# Altium project SPECTRE_3.0.PrjPcb
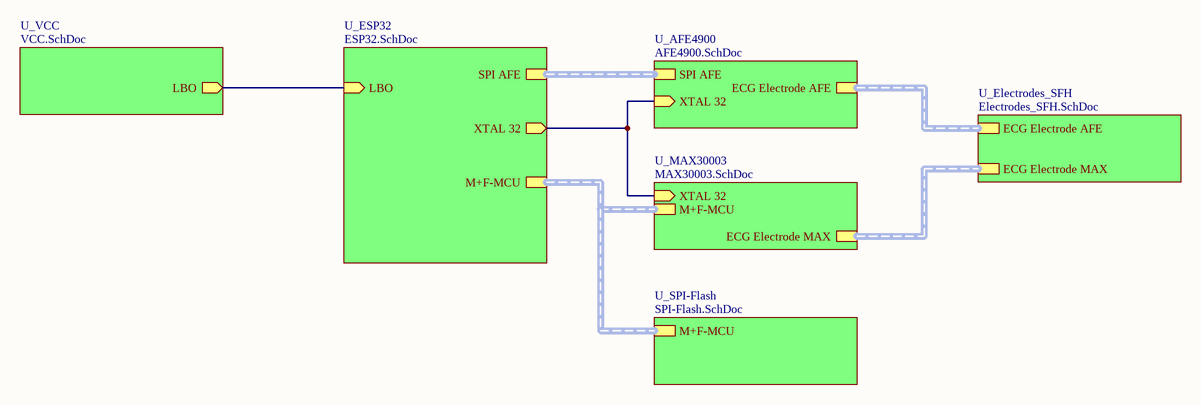
[diagram p0: Topsheet_SPECTRE3.0.SchDoc]
7 sheets, 70 parts. Net scope: hierarchical (ports join the sheet entries above them; power ports are global).
Board file: SPECTRE_3.0.PcbDoc
Sheets:
  Topsheet_SPECTRE3.0.SchDoc
    U_VCC = VCC.SchDoc
    U_Electrodes_SFH = Electrodes_SFH.SchDoc
    U_ESP32 = ESP32.SchDoc
    U_SPI-Flash = SPI-Flash.SchDoc
    U_MAX30003 = MAX30003.SchDoc
    U_AFE4900 = AFE4900.SchDoc

## Sheet Topsheet_SPECTRE3.0.SchDoc
size A4

### Sub-sheets
U_AFE4900 = AFE4900.SchDoc: XTAL 32 (in), ECG Electrode AFE (harness ECG Electrode AFE), SPI AFE (harness SPI AFE)
U_Electrodes_SFH = Electrodes_SFH.SchDoc: ECG Electrode AFE (harness ECG Electrode AFE), ECG Electrode MAX (harness ECG Electrode MAX)
U_ESP32 = ESP32.SchDoc: XTAL 32 (out), M+F-MCU (harness M+F-MCU), SPI AFE (harness SPI AFE), LBO (in)
U_MAX30003 = MAX30003.SchDoc: ECG Electrode MAX (harness ECG Electrode MAX), XTAL 32 (in), M+F-MCU (harness M+F-MCU)
U_SPI-Flash = SPI-Flash.SchDoc: M+F-MCU (harness M+F-MCU)
U_VCC = VCC.SchDoc: LBO (out)

### Nets
AFE CLK: sheet U_ESP32/XTAL 32, sheet U_MAX30003/XTAL 32, sheet U_AFE4900/XTAL 32
NetR19_1: sheet U_VCC/LBO, sheet U_ESP32/LBO

### Buses and harness runs
harness sheet U_AFE4900/ECG Electrode AFE = sheet U_Electrodes_SFH/ECG Electrode AFE
harness sheet U_AFE4900/SPI AFE = sheet U_ESP32/SPI AFE
harness sheet U_Electrodes_SFH/ECG Electrode MAX = sheet U_MAX30003/ECG Electrode MAX
harness sheet U_ESP32/M+F-MCU = sheet U_MAX30003/M+F-MCU = sheet U_SPI-Flash/M+F-MCU

## Sheet VCC.SchDoc
size A4
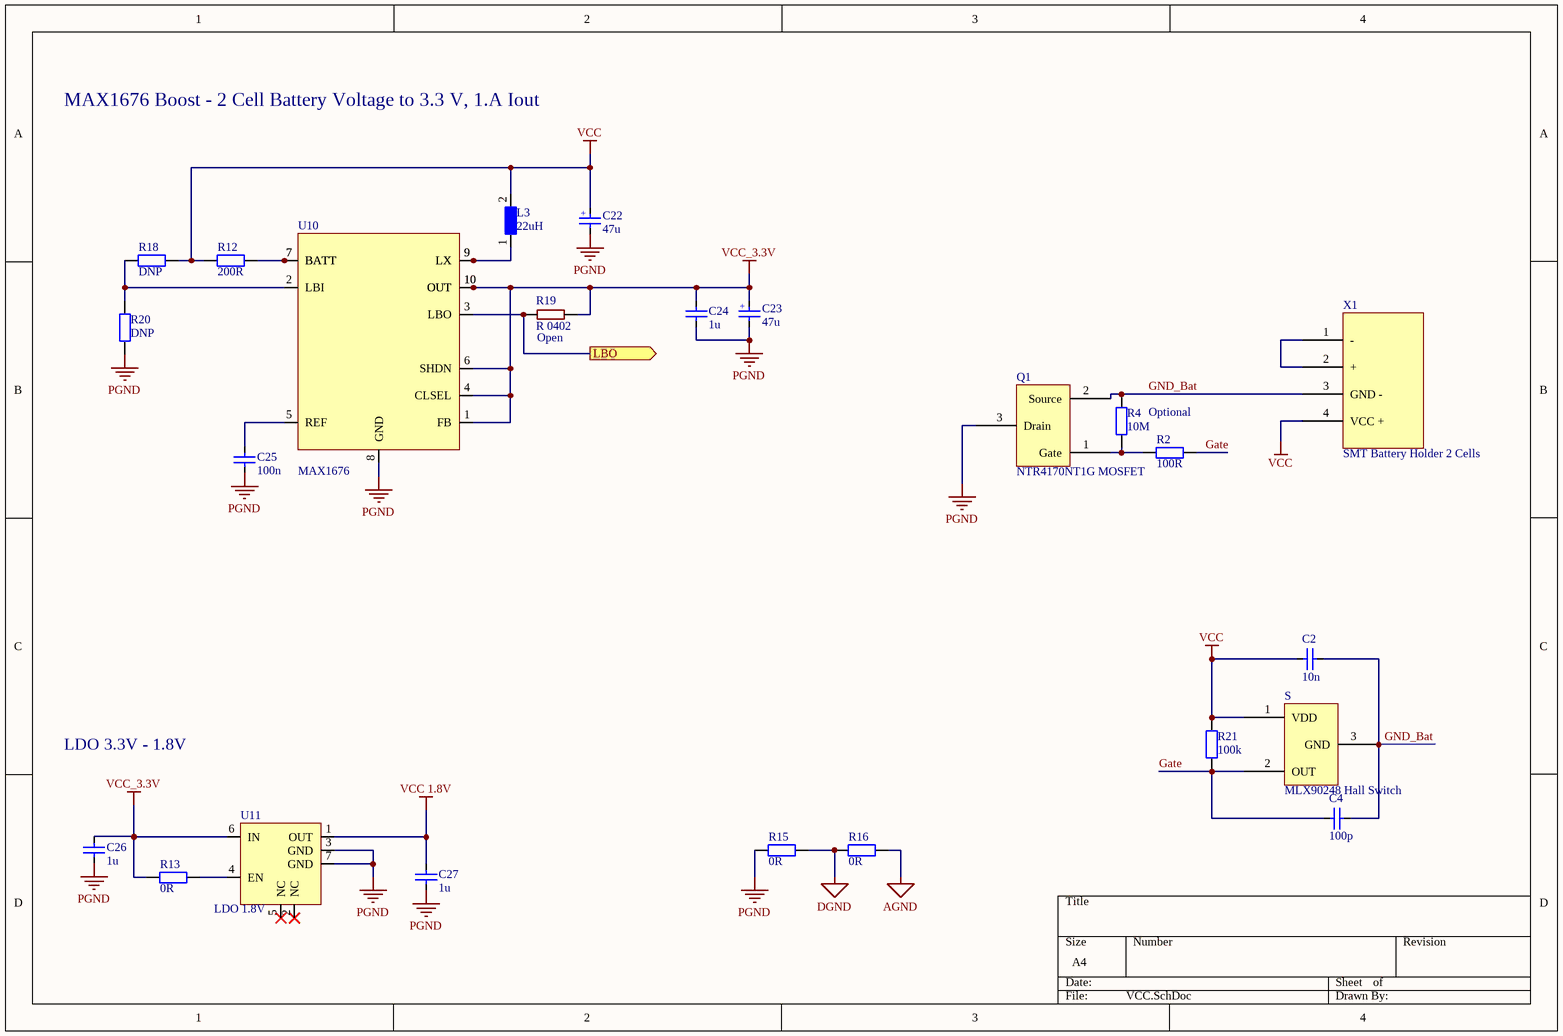
[diagram p1: VCC.SchDoc]

### Parts
C2  10n  [CAPC1005X03N]
C4  100p  [CAPC1005X03N]
C22  47u  [AVX TPSC476M016R0350]
C23  47u  [AVX TPSD107M010R0100 100uF]
C24  1u  [CAPC1608X05N]
C25  100n  [CAPC1608X05N]
C26  1u  [CAPC1608X05N]
C27  1u  [CAPC1608X05N]
L3  22uH  [CD54-220]
Q1  NTR4170NT1G MOSFET  [NTR4170NT1G]
R2  100R  [RESC1005X03N]
R4  10M  [RESC1608X05N]
R12  200R  [RESC1608X05N]
R13  0R  [RESC1608X05N]
R15  0R  [RESC2012X05N]
R16  0R  [RESC2012X05N]
R18  DNP  [RESC1005X03N]
R19  R 0402  [R 0402]
R20  DNP  [RESC1005X03N]
R21  100k  [RESC1005X03N]
S  MLX90248 Hall Switch  [MLX90248]
U10  MAX1676  [MAX1676-Boost]
U11  LDO 1.8V  [TLV75518PDRVR]
X1  SMT Battery Holder 2 Cells  [SMT Battery Holder]

### Ports
LBO (out)

### Nets
AGND: R16.2
DGND: R15.2 R16.1
PGND: C22.2 C23.2 C24.1 C25.2 C26.1 C27.1 Q1.3(Drain) R15.1 R20.1 U10.8(GND) U11.3(GND) U11.7(GND)
VCC: C2.2 C22.1 L3.2 R12.1 R18.2 R21.2 S.1(VDD) X1.4(VCC_+)
VCC 1.8V: C27.2 U11.1(OUT)
VCC_3.3V: C23.1 C24.2 C26.2 R13.1 R19.2 U10.1(FB) U10.4(CLSEL) U10.6(SHDN) U10.10(OUT) U11.6(IN)  [project net TX SUP]
Gate: C4.1 R2.1 R21.1 S.2(OUT)
GND_Bat: C2.1 C4.2 Q1.2(Source) R4.2 S.3(GND) X1.3(GND_-)
NetC25_1: C25.1 U10.5(REF)
NetL3_1: L3.1 U10.9(LX)
NetQ1_1: Q1.1(Gate) R2.2 R4.1
NetR12_2: R12.2 U10.7(BATT)
NetR13_2: R13.2 U11.4(EN)
NetR18_1: R18.1 R20.2 U10.2(LBI)
NetR19_1: R19.1 U10.3(LBO) ; port LBO
NetX1_1: X1.1(-) X1.2(+)

Not connected (* = marked no-connect by the designer): U11 2(NC)* 5(NC)*

### Notes on the sheet
- MAX1676 Boost - 2 Cell Battery Voltage to 3.3 V, 1.A Iout
- (near R19) Open
- Optional
- LDO 3.3V - 1.8V
- (in symbol C_47u_16V_2312) +
- (in symbol C_100u_10V_2917) +

### Library data of the parts
C2 = C_10n_50V_0402: Kondensator 10n 50V 0402; Tested: False; Supplier 1: Farnell; Supplier Part Number 1: 1828887
C4 = C_100p_50V_0402: Kondensator 100p 50V 0402; Tested: False; Supplier 1: Farnell
C22 = C_47u_16V_2312: Kondensator 47u 16V Tanatalum Capacitor; Cart: https://www.mouser.de/ProductDetail/AVX/TPSC476M016R0350?qs=%2Fha2pyFaduhj%252BASDCSGgk2azjUMSnKvo3TkO6PkyHka4p8K%2FssSCRw%3D%3D; Datasheet: https://www.mouser.de/datasheet/2/40/tps-776850.pdf
C23 = C_100u_10V_2917: Kondensator 100u 10V Tanatalum Capacitor; Cart: https://www.mouser.de/ProductDetail/AVX/TPSC476M016R0350?qs=%2Fha2pyFaduhj%252BASDCSGgk2azjUMSnKvo3TkO6PkyHka4p8K%2FssSCRw%3D%3D; Datasheet: https://www.mouser.de/datasheet/2/40/tps-776850.pdf
C24 C26 C27 = C_1u_25V_0603: Kondensator 1u 25V X7R 0603; Tested: False; Supplier 1: Farnell; Supplier Part Number 1: 2495176
C25 = C_100n_50V_0603: Kondensator 100n 50V 0603; Supplier 1: Farnell; Supplier Part Number 1: 1759122
L3 = L_22uH_CD54-220: 22uH power inductor (1.1 A) Sumida CD54-220; Cart: https://www.digikey.de/product-detail/de/sumida-america-components-inc/CD54NP-220MC/308-2271-1-ND/4356341; Datasheet: http://products.sumida.com/products/pdf/CD54.pdf
Q1 = NTR4170NT1G MOSFET: NTR4170NT1G MOSFET 30V 3.9A
R2 = R_100R_0402: Widerstand 100R 1% 0402; Tested: False; Supplier 1: Farnell; Supplier Part Number 1: 9239111
R4 = R_10M_0603: Widerstand 10M 1% 100mW 75V 0603; Tested: False; Supplier 1: Mouser; Supplier Part Number 1: 660-RK73H1JTTD1005F
R12 = R_200R_0603: Widerstand 200R 1% 100mW 50V 0603; Tested: False; Supplier 1: Farnell; Supplier Part Number 1: 2447292
R13 = R_0R_0603: Widerstand 0R 0603; Tested: False; Supplier 1: Farnell; Supplier Part Number 1: 2059527
R15 R16 = R_0R_0805: Widerstand 0R 0805; Tested: False; Supplier 1: Farnell; Supplier Part Number 1: 2057661
R18 R20 = R_0R_0402: Widerstand 0R 0402; Tested: True; Supplier 1: Farnell; Supplier Part Number 1: 2059190
R21 = R_10k_0402: Widerstand 100k 1% 0402; Tested: False; Supplier 1: Farnell; Supplier Part Number 1: 1358069
U10 = MAX1676: Boost, Step-Up DC-DC Converter
U11 = LDO_1.8V_TLV75518PDRVR
X1 = SMT Battery Holder 2 Cells: SMT Battery Holder, Keystone Electronics, 2 Cells AAA; Cart: https://www.digikey.de/product-detail/de/keystone-electronics/1022/36-1022-ND/2137859; Datasheet: https://www.keyelco.com/userAssets/file/M65p23.pdf

## Sheet Electrodes_SFH.SchDoc
size A4
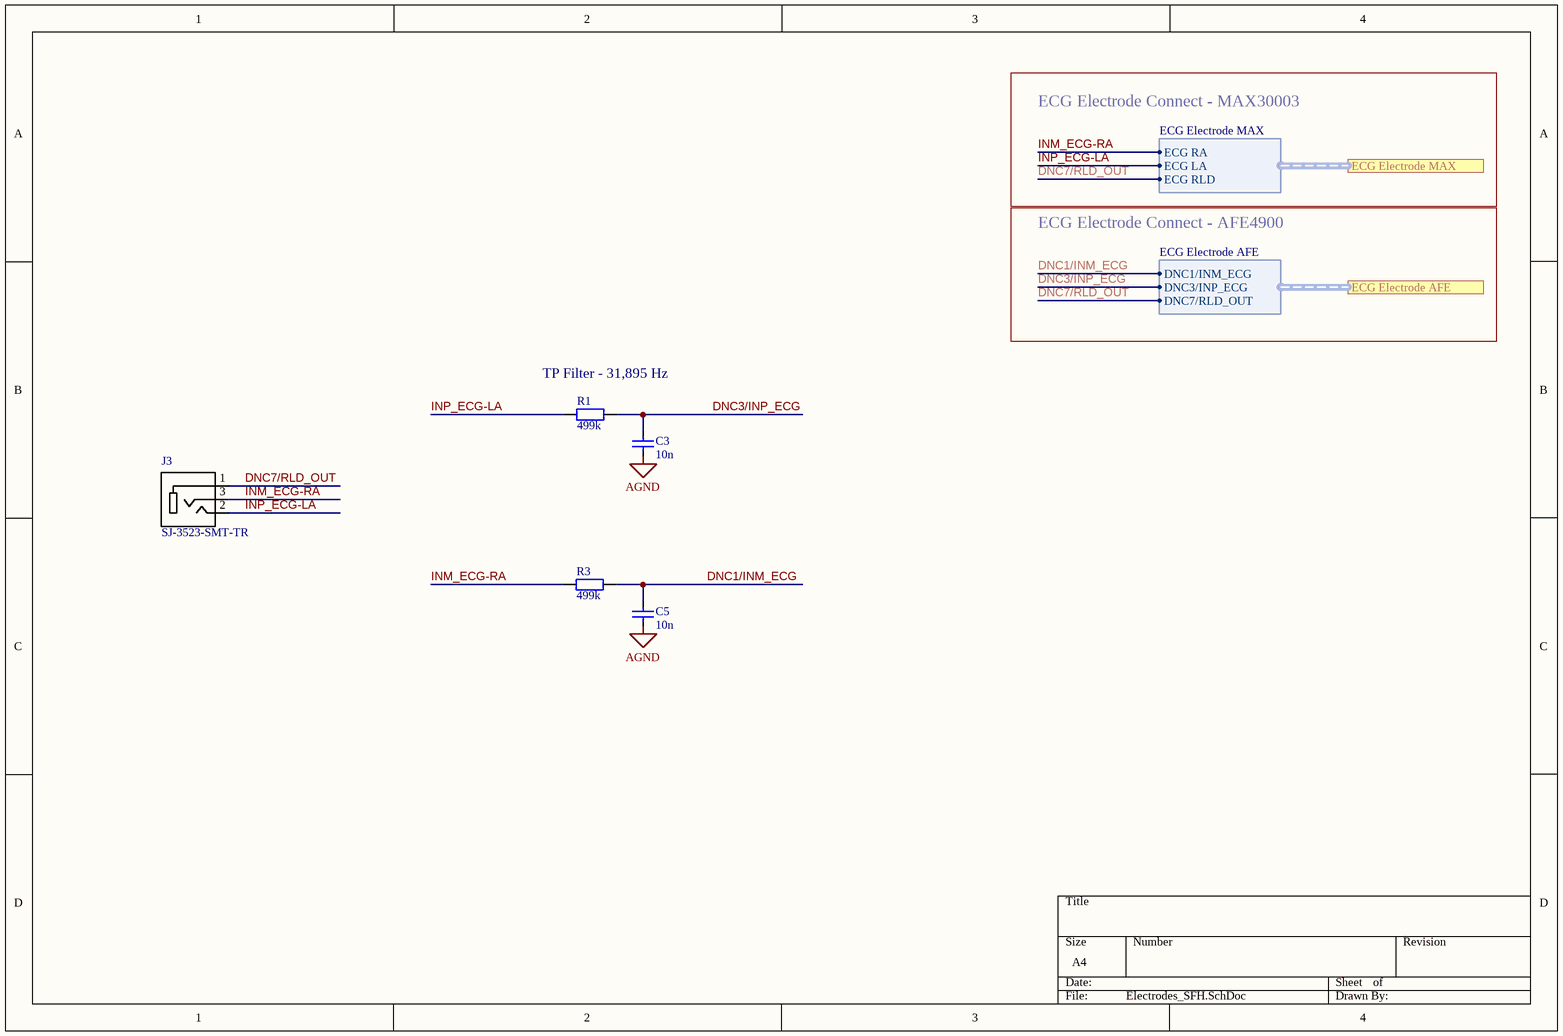
[diagram p2: Electrodes_SFH.SchDoc]

### Parts
C3  10n  [CAPC1005X03N]
C5  10n  [CAPC1005X03N]
J3  SJ-3523-SMT-TR  [*CUI_SJ-3523-SMT-TR]
R1  499k  [RESC1005X03N]
R3  499k  [RESC1005X03N]

### Ports
ECG Electrode AFE (harness ECG Electrode AFE), ECG Electrode MAX (harness ECG Electrode MAX)

### Harnesses
ECG Electrode AFE: DNC3/INP_ECG, DNC7/RLD_OUT, DNC1/INM_ECG
ECG Electrode MAX: ECG RA, ECG LA, ECG RLD

### Nets
AGND: C3.1 C5.1
DNC1/INM_ECG: C5.2 R3.2 ; port ECG Electrode AFE.DNC1/INM_ECG
DNC3/INP_ECG: C3.2 R1.2 ; port ECG Electrode AFE.DNC3/INP_ECG
DNC7/RLD_OUT: J3.1 ; port ECG Electrode AFE.DNC7/RLD_OUT, port ECG Electrode MAX.ECG RLD
INM_ECG-RA: J3.3 R3.1 ; port ECG Electrode MAX.ECG RA  [project net ECG RA]
INP_ECG-LA: J3.2 R1.1 ; port ECG Electrode MAX.ECG LA  [project net ECG LA]

### Notes on the sheet
- ECG Electrode Connect - MAX30003
- ECG Electrode Connect - AFE4900
- (near R1) TP Filter - 31,895 Hz

### Library data of the parts
C3 C5 = C_10n_50V_0402: Kondensator 10n 50V 0402; Tested: False; Supplier 1: Farnell; Supplier Part Number 1: 1828887
R1 R3 = R_0402: Widerstand 0402; Tested: False
J3 = SJ-3523-SMT-TR: Value: *

## Sheet ESP32.SchDoc
size A4
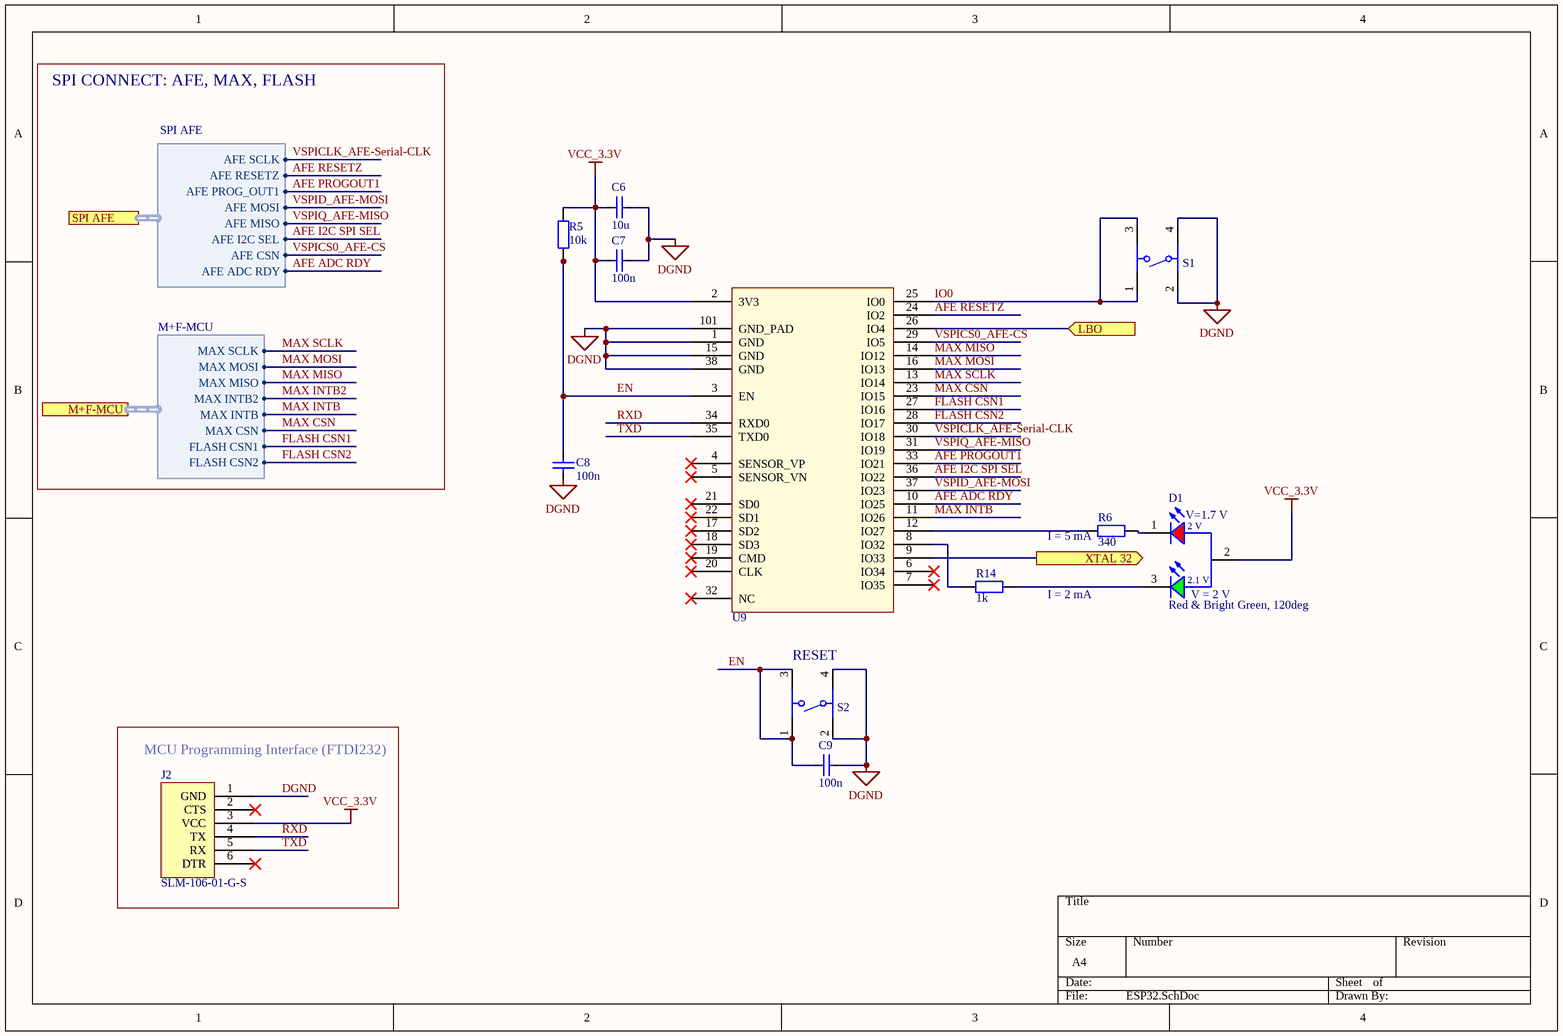
[diagram p3: ESP32.SchDoc]

### Parts
C6  10u  [CAPC1608X05N]
C7  100n  [CAPC1005X03N]
C8  100n  [CAPC1005X03N]
C9  100n  [CAPC1005X03N]
D1  Red & Bright Green, 120deg  [WL-SBSW_1204]
J2  SLM-106-01-G-S  [SLM-106-01-G-S]
R5  10k  [RESC1005X03N]
R6  340  [RESC1005X03N]
R14  1k  [RESC1005X03N]
S1  434153017835  [434153017835]  (value not drawn)
S2  434153017835  [434153017835]  (value not drawn)
U9  ESP32  [ESP32-WROOM-32]  (value not drawn)

### Blocks framed on the sheet
MCU Programming Interface (FTDI232): J2

### Ports
LBO (in), M+F-MCU (harness M+F-MCU), SPI AFE (harness SPI AFE), XTAL 32 (out)

### Harnesses
M+F-MCU: MAX CSN, MAX INTB, MAX INTB2, MAX MISO, MAX MOSI, MAX SCLK, FLASH CSN1, FLASH CSN2
SPI AFE: AFE ADC RDY, AFE CSN, AFE I2C SEL, AFE MISO, AFE MOSI, AFE PROG_OUT1, AFE RESETZ, AFE SCLK

### Nets
DGND: C6.2 C7.2 C8.1 C9.2 J2.1(GND) S1.2 S1.4 S2.2 S2.4 U9.1(GND) U9.15(GND) U9.38(GND) U9.101(GND_PAD)
VCC_3.3V: C6.1 C7.1 D1.2(A) J2.3(VCC) R5.2 U9.2(3V3)  [project net TX SUP]
AFE ADC RDY: U9.10(IO25) ; port SPI AFE.AFE ADC RDY
AFE CLK: U9.9(IO33) ; port XTAL 32
AFE I2C SPI SEL: U9.36(IO22) ; port SPI AFE.AFE I2C SEL
AFE PROGOUT1: U9.33(IO21) ; port SPI AFE.AFE PROG_OUT1
AFE RESETZ: U9.24(IO2) ; port SPI AFE.AFE RESETZ
EN: C8.2 C9.1 R5.1 S2.1 S2.3 U9.3(EN)
FLASH CSN1: U9.27(IO16) ; port M+F-MCU.FLASH CSN1
FLASH CSN2: U9.28(IO17) ; port M+F-MCU.FLASH CSN2
IO0: S1.1 S1.3 U9.25(IO0)
MAX CSN: U9.23(IO15) ; port M+F-MCU.MAX CSN  [project net HSPICS0_MAX-CS]
MAX INTB: U9.11(IO26) ; port M+F-MCU.MAX INTB
MAX INTB2: port M+F-MCU.MAX INTB2
MAX MISO: U9.14(IO12) ; port M+F-MCU.MAX MISO  [project net Flash MISO]
MAX MOSI: U9.16(IO13) ; port M+F-MCU.MAX MOSI  [project net Flash MOSI]
MAX SCLK: U9.13(IO14) ; port M+F-MCU.MAX SCLK  [project net CLK]
RXD: J2.4(TX) U9.34(RXD0)
TXD: J2.5(RX) U9.35(TXD0)
VSPICLK_AFE-Serial-CLK: U9.30(IO18) ; port SPI AFE.AFE SCLK  [project net AFE I2C CLK]
VSPICS0_AFE-CS: U9.29(IO5) ; port SPI AFE.AFE CSN  [project net SEN]
VSPID_AFE-MOSI: U9.37(IO23) ; port SPI AFE.AFE MOSI  [project net AFE I2C DAT]
VSPIQ_AFE-MISO: U9.31(IO19) ; port SPI AFE.AFE MISO  [project net SDOUT]
NetD1_1: D1.1(K) R6.2
NetD1_3: D1.3(K) R14.2
NetR6_1: R6.1 U9.12(IO27)
NetR14_1: R14.1 U9.8(IO32)
NetR19_1: U9.26(IO4) ; port LBO

Not connected (* = marked no-connect by the designer): J2 2(CTS)* 6(DTR)*; U9 4(SENSOR_VP)* 5(SENSOR_VN)* 6(IO34)* 7(IO35)* 17(SD2)* 18(SD3)* 19(CMD)* 20(CLK)* 21(SD0)* 22(SD1)* 32(NC)*

### Notes on the sheet
- SPI CONNECT: AFE, MAX, FLASH
- (near D1) V=1.7 V
- (near R6) I = 5 mA
- I = 2 mA
- (near D1) V = 2 V
- (near S2) RESET
- (in symbol 155124RV73200) 2 V; 2.1 V

### Library data of the parts
C6 = C_10u_10V_0603: Kondensator 10u 10V 0603; Supplier 1: Farnell; Supplier Part Number 1: 2521952
C7-C9 = C_100n_50V_0402: Kondensator 100n 50V 0402; Tested: False; Supplier 1: Farnell; Supplier Part Number 1: 2210822
D1 = 155124RV73200: WL-SBSW SMT Bi-color Side View Waterclear, size 1204, Red & Bright Green, 120deg; Luminous Intensity: 60mcd@Red, 30mcd@Bright Green; Dominant Wavelength: 624nm@Red, 571nm@Bright Green; Forward Voltage: 2V@Red, 2.1V@Bright Green; Peak Wavelength: 632nm@Red, 573nm@Bright Green; Chip Technology: AlInGaP; ComponentLink1Description: Manufacturer; ComponentLink1URL: http://www.we-online.de; ComponentLink2Description: Datasheet; ComponentLink2URL: https://katalog.we-online.de/led/datasheet/155124RV73200.pdf; Emitting Color: Red & Bright Green; Operating Temperature: -40 to +85degC; Mounting Technology: SMT; Part Number: 155124RV73200; Packaging: Tape and Reel; Published Date: October 2019; Publisher: Wurth Elektronik; Size: 1204; Viewing Angle: 120deg
R5 = R_10k_0402: Widerstand 10k 1% 0402; Tested: False; Supplier 1: Farnell; Supplier Part Number 1: 1358069
R6 = R_0R_0402: Widerstand 340R 0402; Tested: True; Supplier 1: Farnell; Supplier Part Number 1: 2059190
R14 = R_1k_0402: Widerstand 1k 1% 0402; Tested: False; Supplier 1: Farnell; Supplier Part Number 1: 2447120
S1 S2 = 434153017835: 3.5x2.9mm SMD J-Bend WS-TASV, height 1.7 mm, 350 gf; Rated Current: 50 mA; Operation Force: 350 gf; Rated Voltage: 12 VDC; ComponentLink1Description: Manufacturer; ComponentLink1URL: http://www.we-online.de; ComponentLink2Description: Datasheet; ComponentLink2URL: http://katalog.we-online.de/em/datasheet/434153017835.pdf; Part Number: 434153017835; Published Date: Nov. 2017; Publisher: Wurth Elektronik; Life Cycle: 200000; Operating Temperature: -40 to +85 degC; Size: 3.5x2.9x1.7 mm
U9 = ESP32-WROOM32: Espressiv ESP32-WROOM32 WLAN Bluetooth Module; HelpURL: https://www.espressif.com/en/products/hardware/esp-wroom-32/overview

## Sheet SPI-Flash.SchDoc
size A4
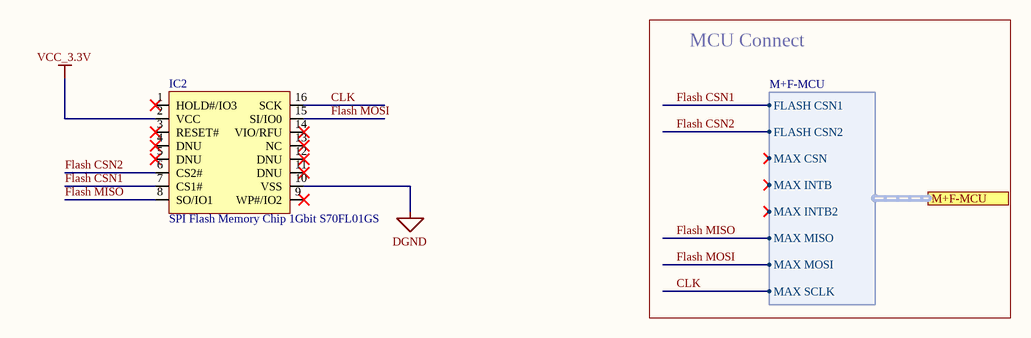
[diagram p4: SPI-Flash.SchDoc]

### Parts
IC2  SPI Flash Memory Chip 1Gbit S70FL01GS  [S70FL01GS]

### Ports
M+F-MCU (harness M+F-MCU)

### Harnesses
M+F-MCU: FLASH CSN1, FLASH CSN2, MAX CSN, MAX INTB, MAX INTB2, MAX MISO, MAX MOSI, MAX SCLK

### Nets
DGND: IC2.10(VSS)
VCC_3.3V: IC2.2(VCC)  [project net TX SUP]
CLK: IC2.16(SCK) ; port M+F-MCU.MAX SCLK
FLASH CSN1: IC2.7(CS1#) ; port M+F-MCU.FLASH CSN1
FLASH CSN2: IC2.6(CS2#) ; port M+F-MCU.FLASH CSN2
Flash MISO: IC2.8(SO/IO1) ; port M+F-MCU.MAX MISO
Flash MOSI: IC2.15(SI/IO0) ; port M+F-MCU.MAX MOSI

Not connected (* = marked no-connect by the designer): IC2 1(HOLD#/IO3)* 3(RESET#)* 4(DNU)* 5(DNU)* 9(WP#/IO2)* 11(DNU)* 12(DNU)* 13(NC)* 14(VIO/RFU)*

### Notes on the sheet
- MCU Connect

## Sheet MAX30003.SchDoc
size A4
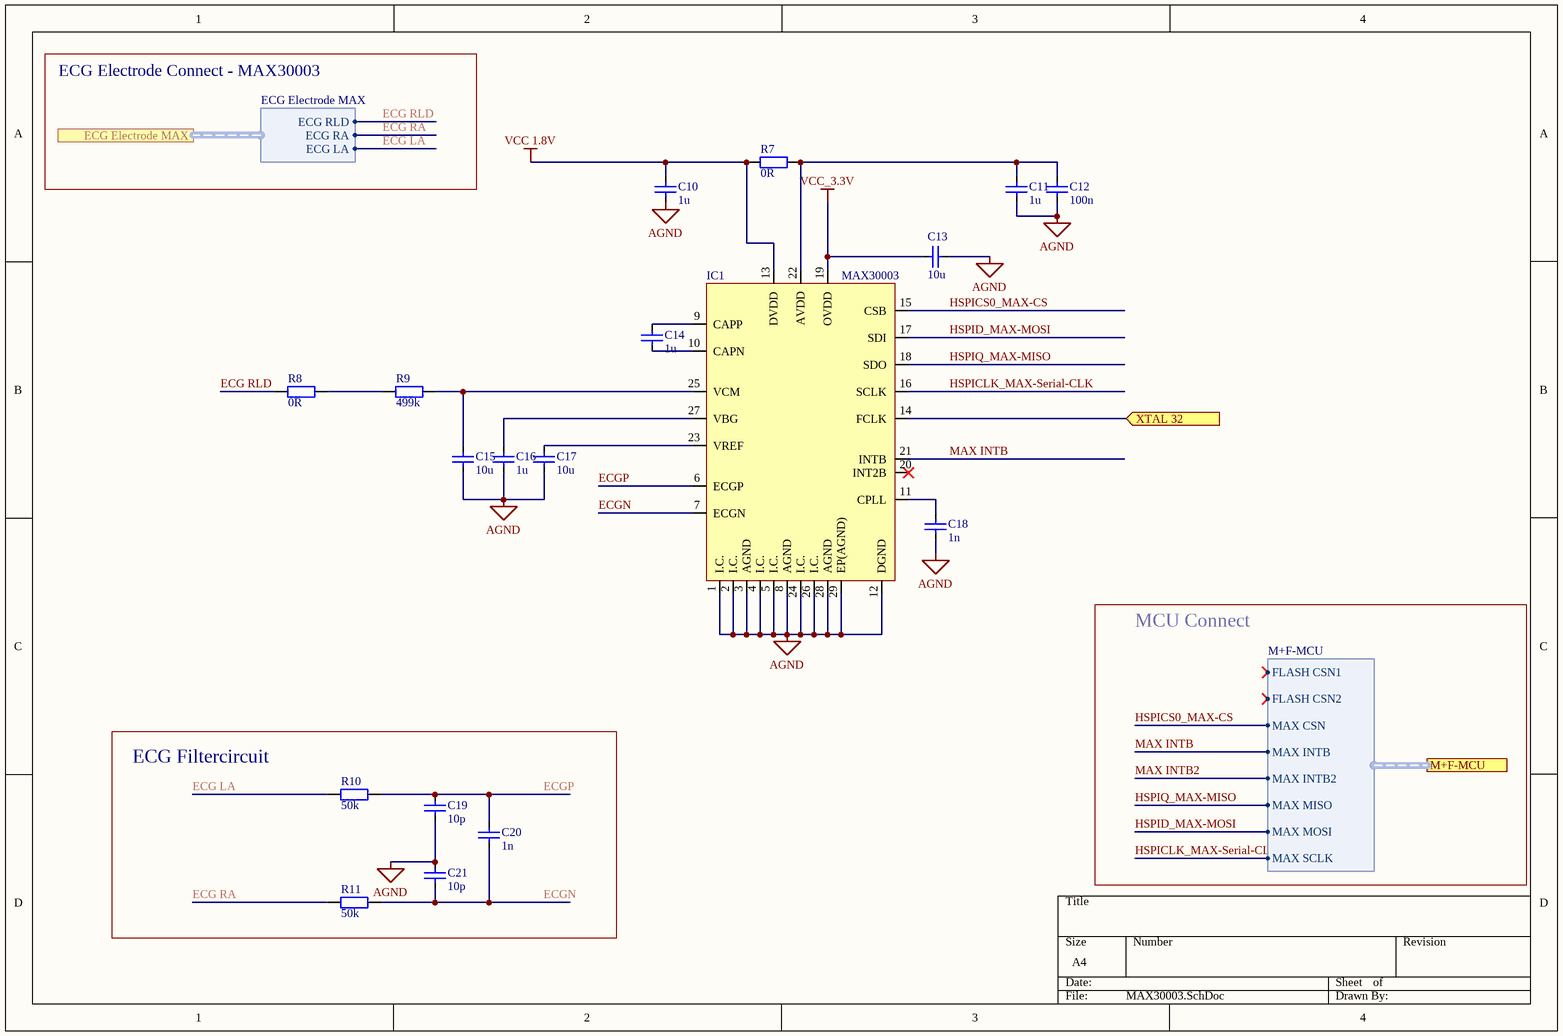
[diagram p5: MAX30003.SchDoc]

### Parts
C10  1u  [CAPC1005X03N]
C11  1u  [CAPC1005X03N]
C12  100n  [CAPC1005X03N]
C13  10u  [CAPC1608X05N]
C14  1u  [CAPC1005X03N]
C15  10u  [CAPC1608X05N]
C16  1u  [CAPC1005X03N]
C17  10u  [CAPC1608X05N]
C18  1n  [CAPC1005X03N]
C19  10p  [CAPC1005X03N]
C20  1n  [CAPC1005X03N]
C21  10p  [CAPC1005X03N]
IC1  MAX30003  [MAX30003CTI+T2855-8]
R7  0R  [RESC1005X03N]
R8  0R  [RESC1005X03N]
R9  499k  [RESC1005X03N]
R10  50k  [RESC1005X03N]
R11  50k  [RESC1005X03N]

### Blocks framed on the sheet
ECG Filtercircuit: C19-C21 R10 R11

### Ports
ECG Electrode MAX (harness ECG Electrode MAX), M+F-MCU (harness M+F-MCU), XTAL 32 (in)

### Harnesses
ECG Electrode MAX: ECG LA, ECG RA, ECG RLD
M+F-MCU: FLASH CSN1, FLASH CSN2, MAX CSN, MAX INTB, MAX INTB2, MAX MISO, MAX MOSI, MAX SCLK

### Nets
AGND: C10.1 C11.1 C12.1 C13.2 C15.1 C16.1 C17.1 C18.1 C19.1 C21.2 IC1.1(I.C.) IC1.2(I.C.) IC1.3(AGND) IC1.4(I.C.) IC1.5(I.C.) IC1.8(AGND) IC1.12(DGND) IC1.24(I.C.) IC1.26(I.C.) IC1.28(AGND) IC1.29(EP(AGND))
VCC 1.8V: C10.2 IC1.13(DVDD) R7.1
VCC_3.3V: C13.1 IC1.19(OVDD)  [project net TX SUP]
AFE CLK: IC1.14(FCLK) ; port XTAL 32
ECG LA: R10.1 ; port ECG Electrode MAX.ECG LA
ECG RA: R11.1 ; port ECG Electrode MAX.ECG RA
ECG RLD: R8.1 ; port ECG Electrode MAX.ECG RLD  [project net DNC7/RLD_OUT]
ECGN: C20.1 C21.1 IC1.7(ECGN) R11.2
ECGP: C19.2 C20.2 IC1.6(ECGP) R10.2
HSPICLK_MAX-Serial-CLK: IC1.16(SCLK) ; port M+F-MCU.MAX SCLK  [project net CLK]
HSPICS0_MAX-CS: IC1.15(CSB) ; port M+F-MCU.MAX CSN
HSPID_MAX-MOSI: IC1.17(SDI) ; port M+F-MCU.MAX MOSI  [project net Flash MOSI]
HSPIQ_MAX-MISO: IC1.18(SDO) ; port M+F-MCU.MAX MISO  [project net Flash MISO]
MAX INTB: IC1.21(INTB) ; port M+F-MCU.MAX INTB
MAX INTB2: port M+F-MCU.MAX INTB2
NetC11_2: C11.2 C12.2 IC1.22(AVDD) R7.2
NetC14_1: C14.1 IC1.10(CAPN)
NetC14_2: C14.2 IC1.9(CAPP)
NetC15_2: C15.2 IC1.25(VCM) R9.2
NetC16_2: C16.2 IC1.27(VBG)
NetC17_2: C17.2 IC1.23(VREF)
NetC18_2: C18.2 IC1.11(CPLL)
NetR8_2: R8.2 R9.1

Not connected (* = marked no-connect by the designer): IC1 20(INT2B)*

### Notes on the sheet
- ECG Electrode Connect - MAX30003
- MCU Connect

### Library data of the parts
C10 C11 C14 C16 = C_1u_6V3_0402: Kondensator 1u 6V3 0402; Tested: False; Supplier 1: Farnell; Supplier Part Number 1: 2672114
C12 = C_100n_50V_0402: Kondensator 100n 50V 0402; Tested: False; Supplier 1: Farnell; Supplier Part Number 1: 2210822
C13 C15 C17 = C_10u_10V_0603: Kondensator 10u 10V 0603; Supplier 1: Farnell; Supplier Part Number 1: 2521952
C18 C20 = C_1n_50V_0402: Kondensator 1n 50V 0402; Tested: False; Supplier 1: Digikey; Supplier Part Number 1: 399-10034-1-ND
C19 C21 = C_10p_25V_NP0_0402: Kondensator 10p 25V NP0 0402; Tested: False; Supplier 1: Mouser; Supplier Part Number 1: 710-885012005040
IC1 = MAX30003CTI+
R7 R8 = R_0R_0402: Widerstand 0R 0402; Tested: True; Supplier 1: Farnell; Supplier Part Number 1: 2059190
R9 = R_0402: Widerstand 0402; Tested: False
R10 R11 = R_0R_0402: Widerstand 50k 0402; Tested: True; Supplier 1: Farnell; Supplier Part Number 1: 2059190

## Sheet AFE4900.SchDoc
size A4
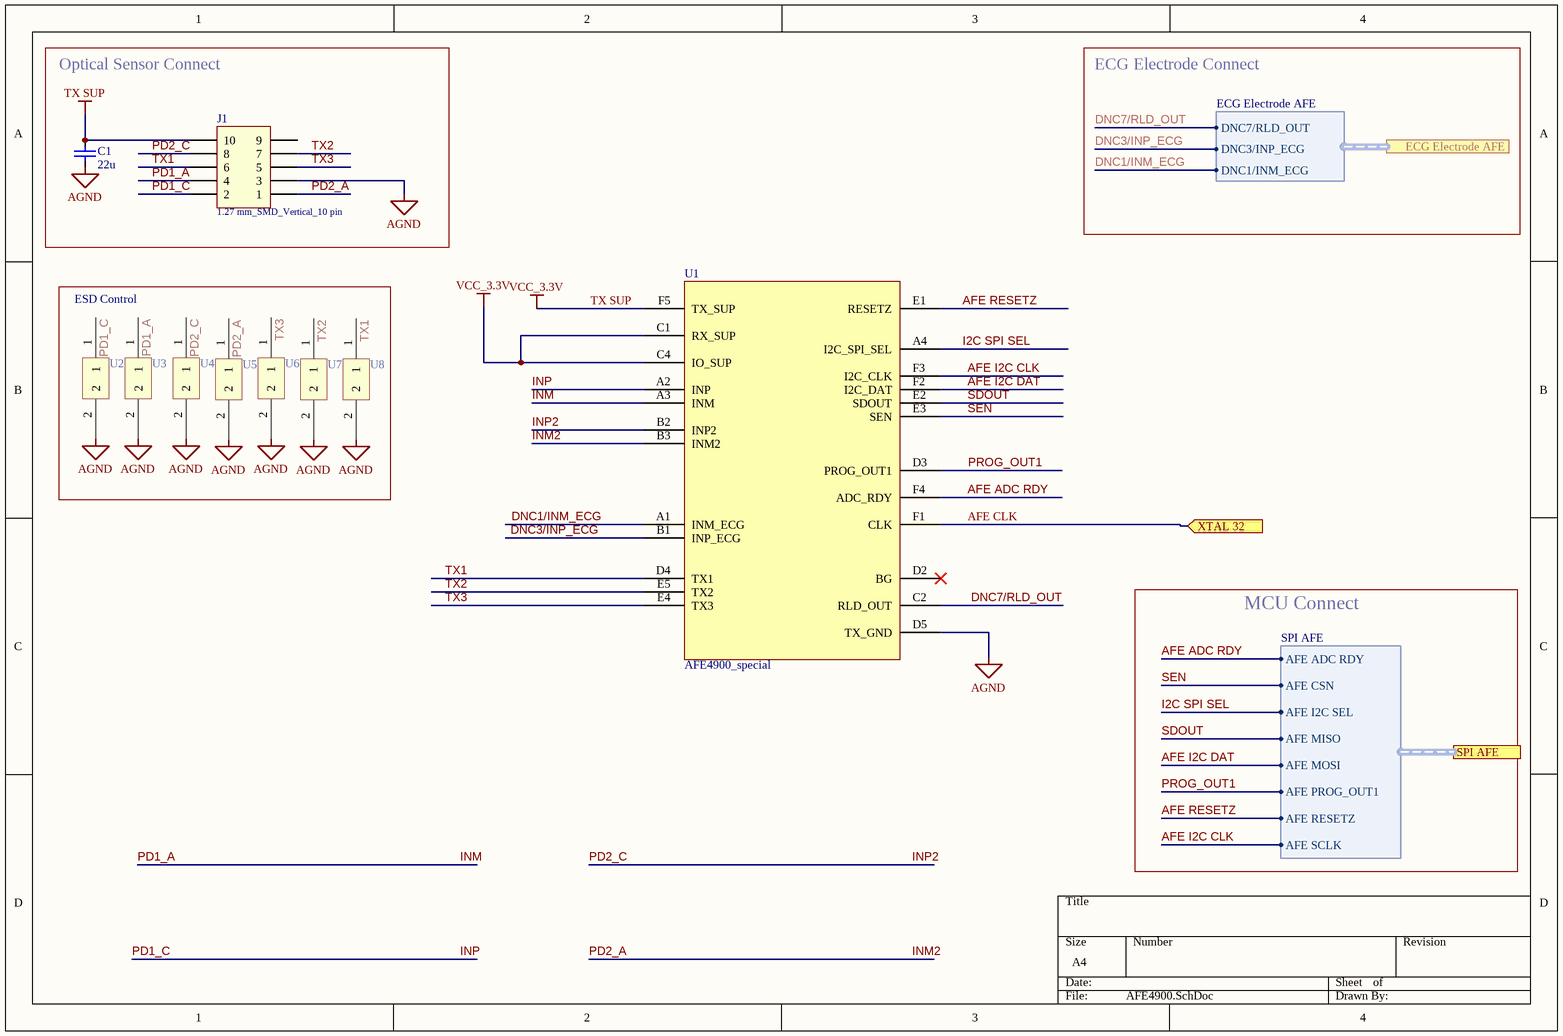
[diagram p6: AFE4900.SchDoc]

### Parts
C1  22u  [CAPC1608X05N]
J1  1.27 mm_SMD_Vertical_10 pin  [62131021021]
U1  AFE4900_special  [AFE4900_Breakout]
U2  TPD1E10B06DPYR  [TPD1E10B06DPYR_0402]  (value not drawn)
U3  TPD1E10B06DPYR  [TPD1E10B06DPYR_0402]  (value not drawn)
U4  TPD1E10B06DPYR  [TPD1E10B06DPYR_0402]  (value not drawn)
U5  TPD1E10B06DPYR  [TPD1E10B06DPYR_0402]  (value not drawn)
U6  TPD1E10B06DPYR  [TPD1E10B06DPYR_0402]  (value not drawn)
U7  TPD1E10B06DPYR  [TPD1E10B06DPYR_0402]  (value not drawn)
U8  TPD1E10B06DPYR  [TPD1E10B06DPYR_0402]  (value not drawn)

### Blocks framed on the sheet
Optical Sensor Connect: C1 J1
ESD Control: U2-U8

### Ports
ECG Electrode AFE (harness ECG Electrode AFE), SPI AFE (harness SPI AFE), XTAL 32 (in)

### Harnesses
ECG Electrode AFE: DNC1/INM_ECG, DNC7/RLD_OUT, DNC3/INP_ECG
SPI AFE: AFE ADC RDY, AFE CSN, AFE I2C SEL, AFE MISO, AFE MOSI, AFE PROG_OUT1, AFE RESETZ, AFE SCLK

### Nets
AGND: C1.1 J1.3 U1.D5(TX_GND) U2.2 U3.2 U4.2 U5.2 U6.2 U7.2 U8.2
TX SUP: C1.2 J1.10 U1.C1(RX_SUP) U1.C4(IO_SUP) U1.F5(TX_SUP)  [also labelled VCC_3.3V]
AFE ADC RDY: U1.F4(ADC_RDY) ; port SPI AFE.AFE ADC RDY
AFE CLK: U1.F1(CLK) ; port XTAL 32
AFE I2C CLK: U1.F3(I2C_CLK) ; port SPI AFE.AFE SCLK
AFE I2C DAT: U1.F2(I2C_DAT) ; port SPI AFE.AFE MOSI
AFE RESETZ: U1.E1(RESETZ) ; port SPI AFE.AFE RESETZ
DNC1/INM_ECG: U1.A1(INM_ECG) ; port ECG Electrode AFE.DNC1/INM_ECG
DNC3/INP_ECG: U1.B1(INP_ECG) ; port ECG Electrode AFE.DNC3/INP_ECG
DNC7/RLD_OUT: U1.C2(RLD_OUT) ; port ECG Electrode AFE.DNC7/RLD_OUT
I2C SPI SEL: U1.A4(I2C_SPI_SEL) ; port SPI AFE.AFE I2C SEL  [project net AFE I2C SPI SEL]
INM: J1.4 U1.A3(INM) U3.1  [also labelled PD1_A]
INM2: J1.1 U1.B3(INM2) U5.1  [also labelled PD2_A]
INP: J1.2 U1.A2(INP) U2.1  [also labelled PD1_C]
INP2: J1.8 U1.B2(INP2) U4.1  [also labelled PD2_C]
PROG_OUT1: U1.D3(PROG_OUT1) ; port SPI AFE.AFE PROG_OUT1  [project net AFE PROGOUT1]
SDOUT: U1.E2(SDOUT) ; port SPI AFE.AFE MISO
SEN: U1.E3(SEN) ; port SPI AFE.AFE CSN
TX1: J1.6 U1.D4(TX1) U8.1
TX2: J1.7 U1.E5(TX2) U7.1
TX3: J1.5 U1.E4(TX3) U6.1

Not connected (* = marked no-connect by the designer): J1 9; U1 D2(BG)*

### Notes on the sheet
- ECG Electrode Connect
- MCU Connect

### Library data of the parts
C1 = C_22u_0603: Kondensator 22u 0603; Tested: False
J1 = 62131021021: Pin Header WR-PHD, pitch 1.27 mm, SMD, Vertical, dual row, 10 pin; Rated Current: 1 A; Pin Number: 10; Pitch: 1.27 mm; Working Voltage: 100 VAC; Contact Resistance: 20 mOhm; Insulation Resistance: >1000 MOhm; ComponentLink1Description: Manufacturer; ComponentLink1URL: http://www.we-online.de; ComponentLink2Description: Datasheet; ComponentLink2URL: http://katalog.we-online.de/em/datasheet/62131021021.pdf; Part Number: 62131021021; Published Date: Jan. 2018; Publisher: Wurth Elektronik; Operating Temperature: -40 to 105 degC; Mounting Technology: SMD; Row Number: Dual; Orientation: Vertical
U1 = AFE4900_special: Synchronized_ECG_and_PPG_AFE
U2-U8 = TPD1E10B06DPYR: TPD1E10B06DPYR 0402

## Nets that join several sheets
AGND: VCC (R16.2), Electrodes_SFH (C3.1 C5.1), MAX30003 (21 pins), AFE4900 (10 pins)
DGND: VCC (R15.2 R16.1), ESP32 (13 pins), SPI-Flash (IC2.10)
TX SUP: VCC (10 pins), ESP32 (6 pins), SPI-Flash (IC2.2), MAX30003 (C13.1 IC1.19), AFE4900 (5 pins)
VCC 1.8V: VCC (C27.2 U11.1), MAX30003 (C10.2 IC1.13 R7.1)
AFE ADC RDY: ESP32 (U9.10), AFE4900 (U1.F4)
AFE CLK: ESP32 (U9.9), MAX30003 (IC1.14), AFE4900 (U1.F1)
AFE I2C CLK: ESP32 (U9.30), AFE4900 (U1.F3)
AFE I2C DAT: ESP32 (U9.37), AFE4900 (U1.F2)
AFE I2C SPI SEL: ESP32 (U9.36), AFE4900 (U1.A4)
AFE PROGOUT1: ESP32 (U9.33), AFE4900 (U1.D3)
AFE RESETZ: ESP32 (U9.24), AFE4900 (U1.E1)
CLK: ESP32 (U9.13), SPI-Flash (IC2.16), MAX30003 (IC1.16)
DNC1/INM_ECG: Electrodes_SFH (C5.2 R3.2), AFE4900 (U1.A1)
DNC3/INP_ECG: Electrodes_SFH (C3.2 R1.2), AFE4900 (U1.B1)
DNC7/RLD_OUT: Electrodes_SFH (J3.1), MAX30003 (R8.1), AFE4900 (U1.C2)
ECG LA: Electrodes_SFH (J3.2 R1.1), MAX30003 (R10.1)
ECG RA: Electrodes_SFH (J3.3 R3.1), MAX30003 (R11.1)
FLASH CSN1: ESP32 (U9.27), SPI-Flash (IC2.7)
FLASH CSN2: ESP32 (U9.28), SPI-Flash (IC2.6)
Flash MISO: ESP32 (U9.14), SPI-Flash (IC2.8), MAX30003 (IC1.18)
Flash MOSI: ESP32 (U9.16), SPI-Flash (IC2.15), MAX30003 (IC1.17)
HSPICS0_MAX-CS: ESP32 (U9.23), MAX30003 (IC1.15)
MAX INTB: ESP32 (U9.11), MAX30003 (IC1.21)
NetR19_1: VCC (R19.1 U10.3), ESP32 (U9.26)
SDOUT: ESP32 (U9.31), AFE4900 (U1.E2)
SEN: ESP32 (U9.29), AFE4900 (U1.E3)